# EAGLE design weaver_bicolor (EAGLE 7.4.0)
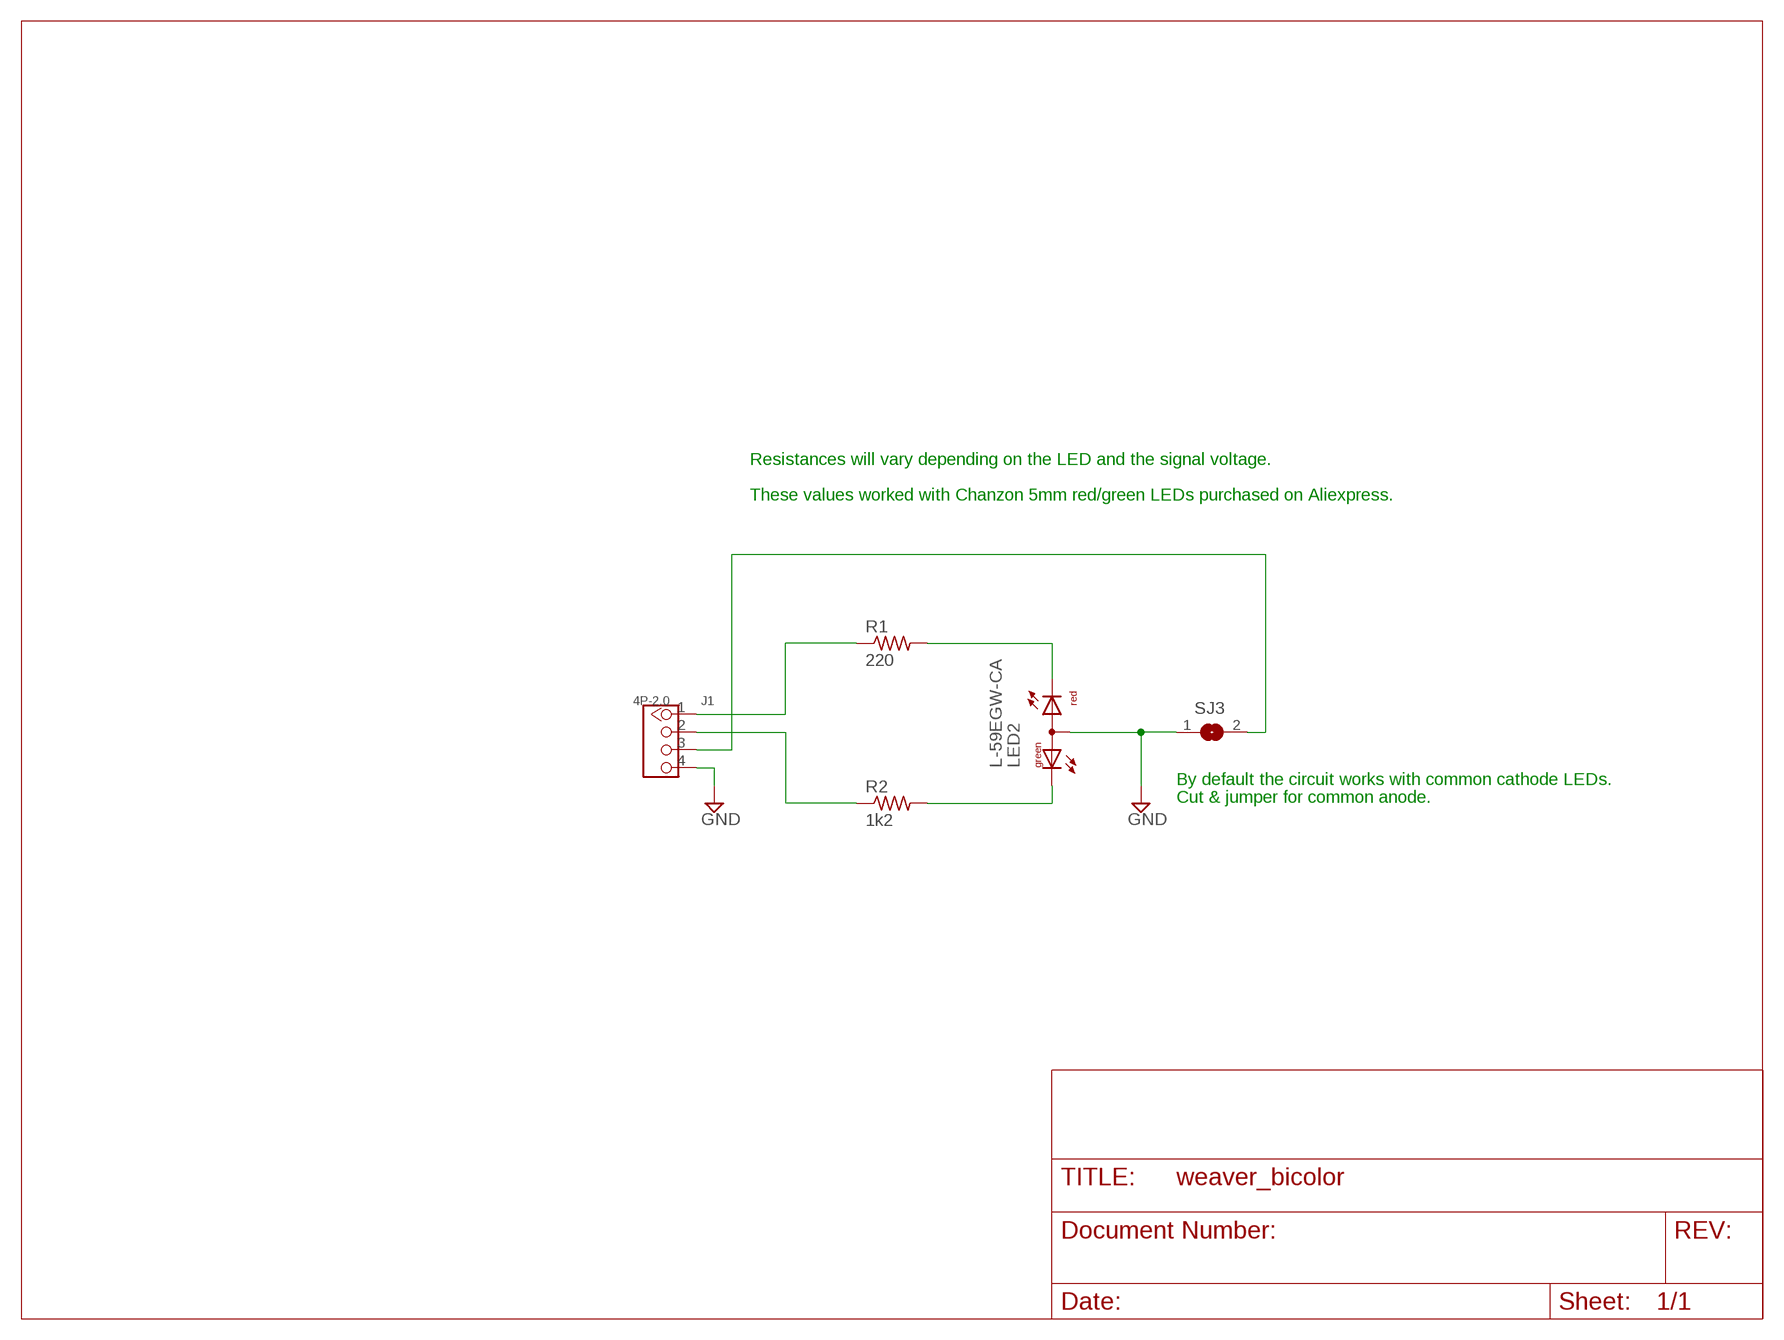
[diagram p0: schematic, sheet 1]

## Parts
J1  4P-2.0  GROVE-CONNECTOR-DIP(4P-2.0)  [HW4-2.0]
LED2  L-59EGW-CA  [L-59EGW-CA]
R1  220  R-US_R0805  [R0805]
R2  1k2  R-US_R0805  [R0805]
SJ3  SJ  [SJ]

## Nets
GND: J1.4 LED2.2(A) SJ3.1
N$1: LED2.1(CR) R1.2
N$2: LED2.3(CG) R2.2
N$3: J1.1 R1.1
N$4: J1.2 R2.1
N$7: J1.3 SJ3.2

## Notes on the sheet
- Resistances will vary depending on the LED and the signal voltage.
- These values worked with Chanzon 5mm red/green LEDs purchased on Aliexpress.
- By default the circuit works with common cathode LEDs.
- Cut & jumper for common anode.

## Library data of the parts
J1 = NanoPlaygroundFace:GROVE-CONNECTOR-DIP(4P-2.0): 320110033
LED2 = led:L-59EGW-CA: T-1 3/4 (5mm) BI-COLOR INDICATOR LAMP Source: http://www.kingbright.com/manager/upload/pdf/L-59EGW-CA%28Ver1292805989.13%29
R1 R2 = resistor:R-US_: RESISTOR, American symbol
SJ3 = jumper:SJ: SMD solder JUMPER

## Net classes
0 default: width 0.305 mm, drill 0.508 mm, clearance 0.254 mm

## Board
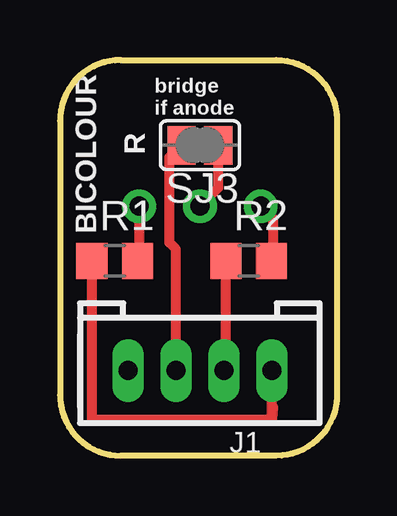
[diagram p1: board, top side]
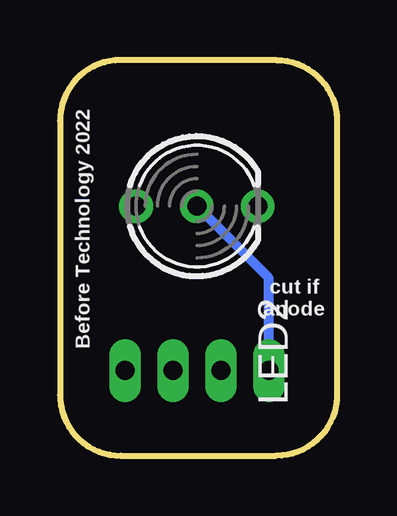
[diagram p2: board, bottom side, seen from below]

Size 11.56 x 16.51 mm. Coordinates in mm from the lower left corner, seen from the top.
Outline: 0,13.97 0,2.54 arc90 2.54,0 9.02,0 arc90 11.56,2.54 11.56,13.97 arc90 9.02,16.51 2.54,16.51 arc90 0,13.97
Copper layers (1*16): Top 0.035mm / dielectric 1.5mm / Bottom 0.035mm
Design rules "default *": minimum track width 10mil, minimum drill 20mil, track to track 8mil, track to pad 8mil, pad to pad 8mil, via to via 8mil, smd to smd 8mil, copper to edge 40mil, drill to drill 8mil, minimum pad ring 10mil, minimum via ring 8mil, stop-mask expansion 4mil, vias tented up to drill 0mil, thermal gap 10mil

### Footprints (pad centres in the part's own frame; a part is rotated, then mirrored left to right if it is on the bottom)
HW4-2.0 = drill 0.8 pad 1.27 long: 1 -3,0; 2 -1,0; 3 1,0; 4 3,0
L-59EGW-CA = drill 0.8 pad 1.4: 1 0,2.54; 2 0,0; 3 0,-2.54
R0805 = smd 1.3 x 1.5: 1 -0.95,0; 2 0.95,0
SJ = smd 1.168 x 1.6: 1 -0.762,0; 2 0.762,0

### Placement (x,y rotation side)
J1  5.84,3.56 180 top
LED2  5.84,10.41 270 bottom
R1  2.29,8.13 0 top
R2  7.87,8.13 0 top
SJ3  5.84,12.95 180 top

### Tracks (layer width: path | path; a pad name or v marks a point on that pad's centre or on a via)
GND
  Top 0.406: SJ3.1 6.6,11.18 LED2.2
  Bottom 0.406: J1.4 2.84,7.41 LED2.2
N$1
  Top 0.406: LED2.1 3.3,8.19 R1.2
N$2
  Top 0.406: LED2.3 8.89,9.91 8.89,8.19 R2.2
N$3
  Top 0.406: 8.84,1.52 1.34,1.52 R1.1 | 8.89,2.03 8.84,1.52 | 8.84,1.52 J1.1
N$4
  Top 0.406: J1.2 6.92,3.56 R2.1
N$7
  Top 0.406: J1.3 4.84,8.62 4.57,8.89 4.57,12.45 SJ3.2

### Text on the board
tPlace: bridge / if anode | R | BICOLOUR
bPlace: Before Technology 2022 | cut if / anode